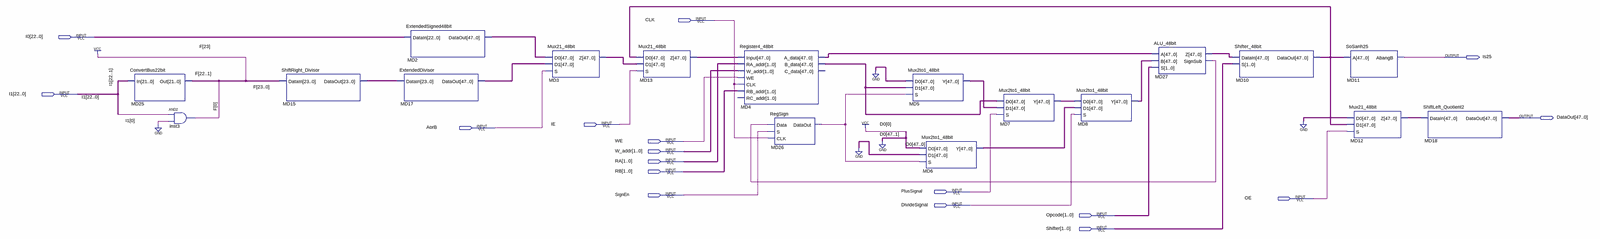
[diagram p0: schematic sheet, whole]
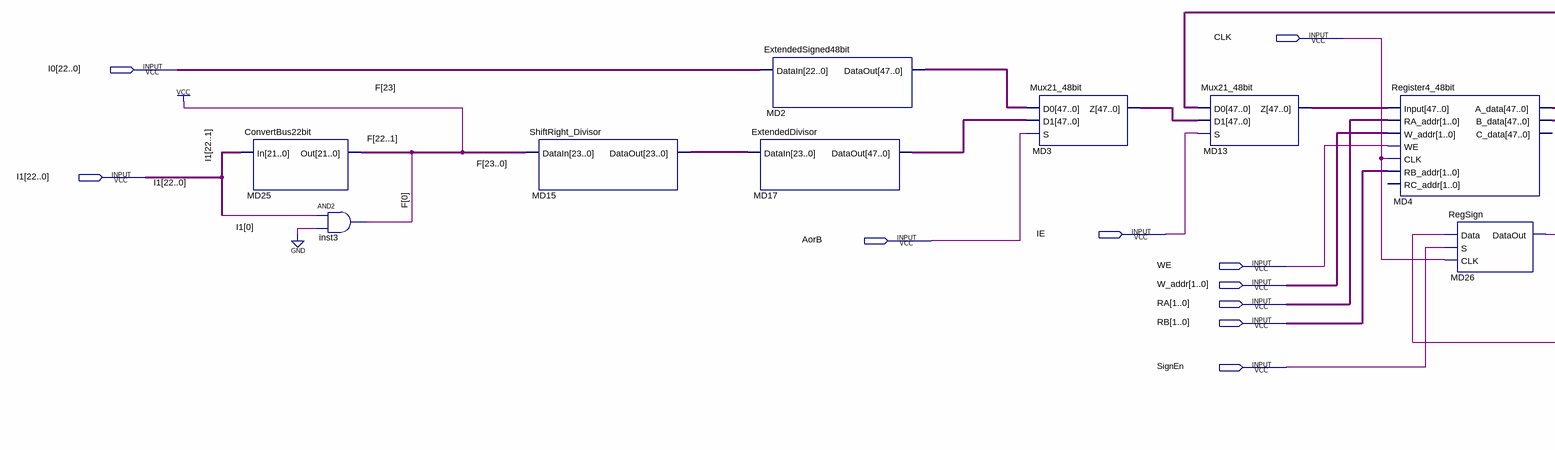
[diagram p1: schematic sheet, left part]
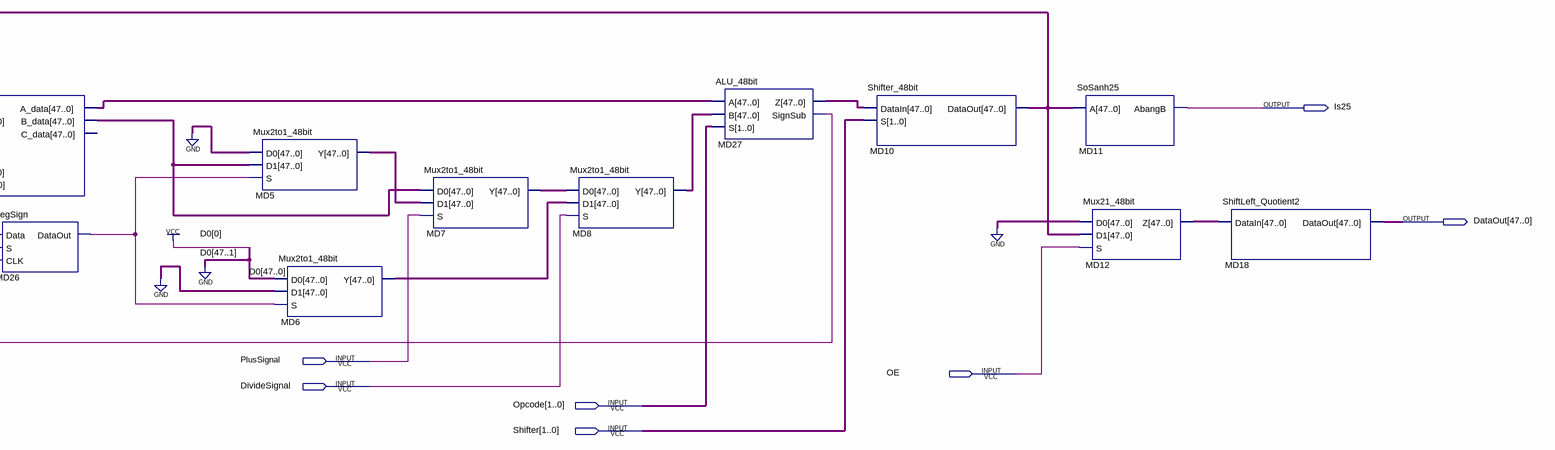
[diagram p2: schematic sheet, right part]
// Quartus schematic DatapathDivision.bdf as structural Verilog: 18 symbols, 17 pins
module DatapathDivision (
  input  CLK,
  input  [22:0] I0,
  input  [22:0] I1,
  input  IE,
  input  AorB,
  input  WE,
  input  [1:0] W_addr,
  input  [1:0] RA,
  input  [1:0] RB,
  input  PlusSignal,
  input  SignEn,
  input  OE,
  input  DivideSignal,
  input  [1:0] Opcode,
  input  [1:0] Shifter,
  output Is25,
  output [47:0] DataOut
);

  wire MD26_dataout, MD27_signsub;
  wire [22:0] F;
  wire [23:0] MD15_dataout;
  wire [47:0] MD2_dataout, MD3_z, MD4_a_data, MD4_b_data, MD5_y, MD6_y, MD7_y, MD8_y, MD10_dataout, MD12_z,
       MD13_z, MD17_dataout, MD27_z;

  ConvertBus22bit MD25 (.In(I1[22:1]), .Out(F[22:1]));
  and inst3 (F[0], I1[0], 1'b0);
  ShiftRight_Divisor MD15 (.DataIn({1'b1, F}), .DataOut(MD15_dataout));
  ExtendedSigned48bit MD2 (.DataIn(I0), .DataOut(MD2_dataout));
  ExtendedDivisor MD17 (.DataIn(MD15_dataout), .DataOut(MD17_dataout));
  Mux21_48bit MD3 (.D0(MD2_dataout), .D1(MD17_dataout), .S(AorB), .Z(MD3_z));
  Mux21_48bit MD13 (.D0(MD10_dataout), .D1(MD3_z), .S(IE), .Z(MD13_z));
  Register4_48bit MD4 (
    .Input(MD13_z), .RA_addr(RA), .W_addr(W_addr), .WE(WE), .CLK(CLK), .RB_addr(RB), .A_data(MD4_a_data),
    .B_data(MD4_b_data));  // open: RC_addr, C_data
  RegSign MD26 (.Data(MD27_signsub), .S(SignEn), .CLK(CLK), .DataOut(MD26_dataout));
  Mux2to1_48bit MD5 (.D0({48{1'b0}}), .D1(MD4_b_data), .S(MD26_dataout), .Y(MD5_y));
  Mux2to1_48bit MD6 (
    .D0(48'b000000000000000000000000000000000000000000000001), .D1({48{1'b0}}), .S(MD26_dataout), .Y(MD6_y));
  Mux2to1_48bit MD7 (.D0(MD4_b_data), .D1(MD5_y), .S(PlusSignal), .Y(MD7_y));
  Mux2to1_48bit MD8 (.D0(MD7_y), .D1(MD6_y), .S(DivideSignal), .Y(MD8_y));
  ALU_48bit MD27 (.A(MD4_a_data), .B(MD8_y), .S(Opcode), .Z(MD27_z), .SignSub(MD27_signsub));
  Shifter_48bit MD10 (.DataIn(MD27_z), .S(Shifter), .DataOut(MD10_dataout));
  SoSanh25 MD11 (.A(MD10_dataout), .AbangB(Is25));
  Mux21_48bit MD12 (.D0({48{1'b0}}), .D1(MD10_dataout), .S(OE), .Z(MD12_z));
  ShiftLeft_Quotient2 MD18 (.DataIn(MD12_z), .DataOut(DataOut));
endmodule
